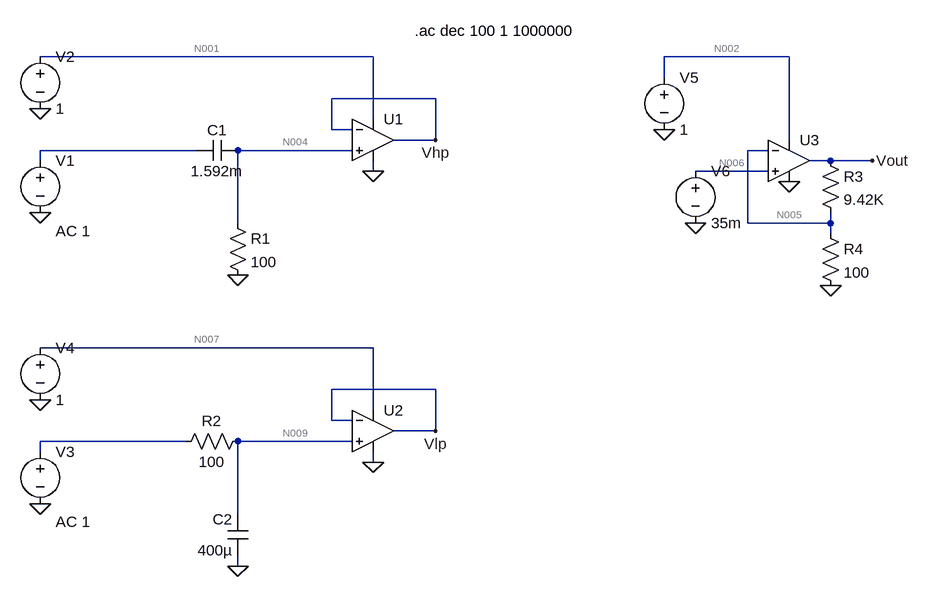
[diagram p0: schematic Non-Cascaded_Filter.asc]
Non-Cascaded_Filter.asc, the LTspice schematic file:
Version 4
SHEET 1 1160 708
WIRE 320 -96 -192 -96
WIRE 960 -96 768 -96
WIRE 768 -64 768 -96
WIRE 416 -32 256 -32
WIRE 320 0 320 -96
WIRE 256 16 256 -32
WIRE 288 16 256 16
WIRE 416 32 416 -32
WIRE 416 32 352 32
WIRE 960 32 960 -96
WIRE 48 48 -192 48
WIRE 288 48 112 48
WIRE 928 48 896 48
WIRE -192 64 -192 48
WIRE 1024 64 992 64
WIRE 1088 64 1024 64
WIRE 320 80 320 64
WIRE 928 80 816 80
WIRE 112 160 112 48
WIRE 896 160 896 48
WIRE 1024 160 1024 144
WIRE 1024 160 896 160
WIRE 1024 176 1024 160
WIRE 320 352 -192 352
WIRE 416 416 256 416
WIRE 320 448 320 352
WIRE 256 464 256 416
WIRE 288 464 256 464
WIRE 416 480 416 416
WIRE 416 480 352 480
WIRE 32 496 -192 496
WIRE 288 496 112 496
WIRE -192 512 -192 496
WIRE 320 528 320 512
WIRE 112 608 112 496
WIRE 112 688 112 672
FLAG -192 144 0
FLAG 112 240 0
FLAG -192 -16 0
FLAG 320 80 0
FLAG 416 32 Vhp
FLAG -192 592 0
FLAG 112 688 0
FLAG -192 432 0
FLAG 320 528 0
FLAG 416 480 Vlp
FLAG 960 96 0
FLAG 768 16 0
FLAG 816 160 0
FLAG 1024 256 0
FLAG 1088 64 Vout
SYMBOL cap 112 32 R90
WINDOW 0 0 32 VBottom 2
WINDOW 3 32 32 VTop 2
SYMATTR InstName C1
SYMATTR Value 1.592m
SYMBOL res 96 144 R0
SYMATTR InstName R1
SYMATTR Value 100
SYMBOL voltage -192 48 R0
WINDOW 123 24 124 Left 2
WINDOW 39 0 0 Left 0
SYMATTR Value2 AC 1
SYMATTR InstName V1
SYMATTR Value ""
SYMBOL OpAmps\\UniversalOpAmp 320 32 R0
SYMATTR InstName U1
SYMBOL voltage -192 -112 R0
WINDOW 123 0 0 Left 0
WINDOW 39 0 0 Left 0
SYMATTR InstName V2
SYMATTR Value 1
SYMBOL cap 128 672 R180
WINDOW 0 24 56 Left 2
WINDOW 3 24 8 Left 2
SYMATTR InstName C2
SYMATTR Value 400µ
SYMBOL res 128 480 R90
WINDOW 0 0 56 VBottom 2
WINDOW 3 32 56 VTop 2
SYMATTR InstName R2
SYMATTR Value 100
SYMBOL voltage -192 496 R0
WINDOW 123 24 124 Left 2
WINDOW 39 0 0 Left 0
SYMATTR Value2 AC 1
SYMATTR InstName V3
SYMATTR Value ""
SYMBOL OpAmps\\UniversalOpAmp 320 480 R0
SYMATTR InstName U2
SYMBOL voltage -192 336 R0
WINDOW 123 0 0 Left 0
WINDOW 39 0 0 Left 0
SYMATTR InstName V4
SYMATTR Value 1
SYMBOL OpAmps\\UniversalOpAmp 960 64 R0
SYMATTR InstName U3
SYMBOL voltage 768 -80 R0
WINDOW 123 0 0 Left 0
WINDOW 39 0 0 Left 0
SYMATTR InstName V5
SYMATTR Value 1
SYMBOL voltage 816 64 R0
WINDOW 123 0 0 Left 0
WINDOW 39 0 0 Left 0
SYMATTR InstName V6
SYMATTR Value 35m
SYMBOL res 1008 48 R0
SYMATTR InstName R3
SYMATTR Value 9.42K
SYMBOL res 1008 160 R0
SYMATTR InstName R4
SYMATTR Value 100
TEXT 384 -136 Left 2 !.ac dec 100 1 1000000

The netlist it stands for:
* Non-Cascaded_Filter.asc
C1 N004 N003 1.592m
R1 N004 0 100
V1 N003 0 AC 1
XU1 N004 Vhp N001 0 Vhp level1 Avol=1Meg GBW=10Meg Vos=0 En=0 Enk=0 In=0 Ink=0 Rin=500Meg  ; pins In+ In- V+ V- OUT
V2 N001 0 1
C2 0 N009 400µ
R2 N009 N008 100
V3 N008 0 AC 1
XU2 N009 Vlp N007 0 Vlp level1 Avol=1Meg GBW=10Meg Vos=0 En=0 Enk=0 In=0 Ink=0 Rin=500Meg  ; pins In+ In- V+ V- OUT
V4 N007 0 1
XU3 N006 N005 N002 0 Vout level1 Avol=1Meg GBW=10Meg Vos=0 En=0 Enk=0 In=0 Ink=0 Rin=500Meg  ; pins In+ In- V+ V- OUT
V5 N002 0 1
V6 N006 0 35m
R3 Vout N005 9.42K
R4 N005 0 100
.ac dec 100 1 1000000
.lib UniversalOpAmp1.lib
.backanno
.end

* Results of the author's LTspice run, read from the files saved beside the schematic
* Operating Point, zero values left out:
*   V(n004) = 100 nV
*   V(vhp) = 100 nV
*   V(n001) = 1 V
*   V(n009) = 100 nV
*   V(vlp) = 100 nV
*   V(n007) = 1 V
*   V(n005) = 35 mV
*   V(n006) = 35 mV
*   V(vout) = 3.332 V
*   V(n002) = 1 V
*   I(R1) = 1 nA
*   I(R2) = 1 nA
*   I(R3) = 350 µA
*   I(R4) = 350 µA
*   I(V2) = -2 nA
*   I(V3) = 1 nA
*   I(V4) = -2 nA
*   I(V5) = -1.93 nA
*   I(V6) = 930 pA
*   Ix(u1:1) = -1 nA
*   Ix(u1:2) = -1 nA
*   Ix(u1:3) = 2 nA
*   Ix(u1:5) = 1.621 nA
*   Ix(u2:1) = -1 nA
*   Ix(u2:2) = -1 nA
*   Ix(u2:3) = 2 nA
*   Ix(u2:5) = 1.621 nA
*   Ix(u3:1) = -930 pA
*   Ix(u3:2) = -930 pA
*   Ix(u3:3) = 1.93 nA
*   Ix(u3:4) = -70 pA
*   Ix(u3:5) = -350 µA
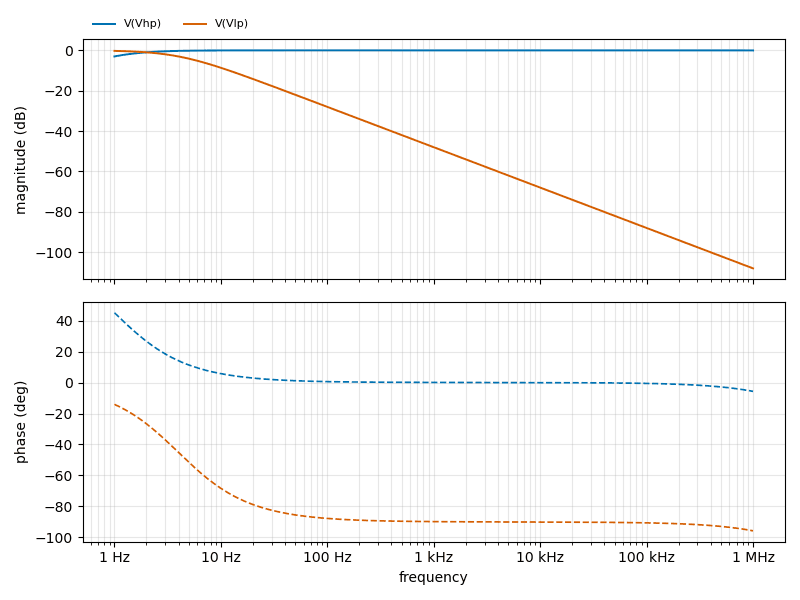
[diagram p1: AC Analysis of Non-Cascaded_Filter.asc, plotted from the saved traces]
* AC Analysis, 1 run:
*   V(Vhp): -3.01 dB at 1 Hz, -0.04 dB at 1 MHz, peak -0.00 dB at 3.162 kHz
*   V(Vlp): -0.27 dB at 1 Hz, -108.05 dB at 1 MHz, peak -0.27 dB at 1 Hz, 3 dB below the peak at 4.222 Hz